# EasyEDA schematic SCH_SMD VR Conditioner_2023-05-26.json
TITLE: Sheet_1; REV: 1.0; Date: 2022-03-04; Sheet: 1/1; Drawn By: Norman Alphaspeed; Company: Your Company
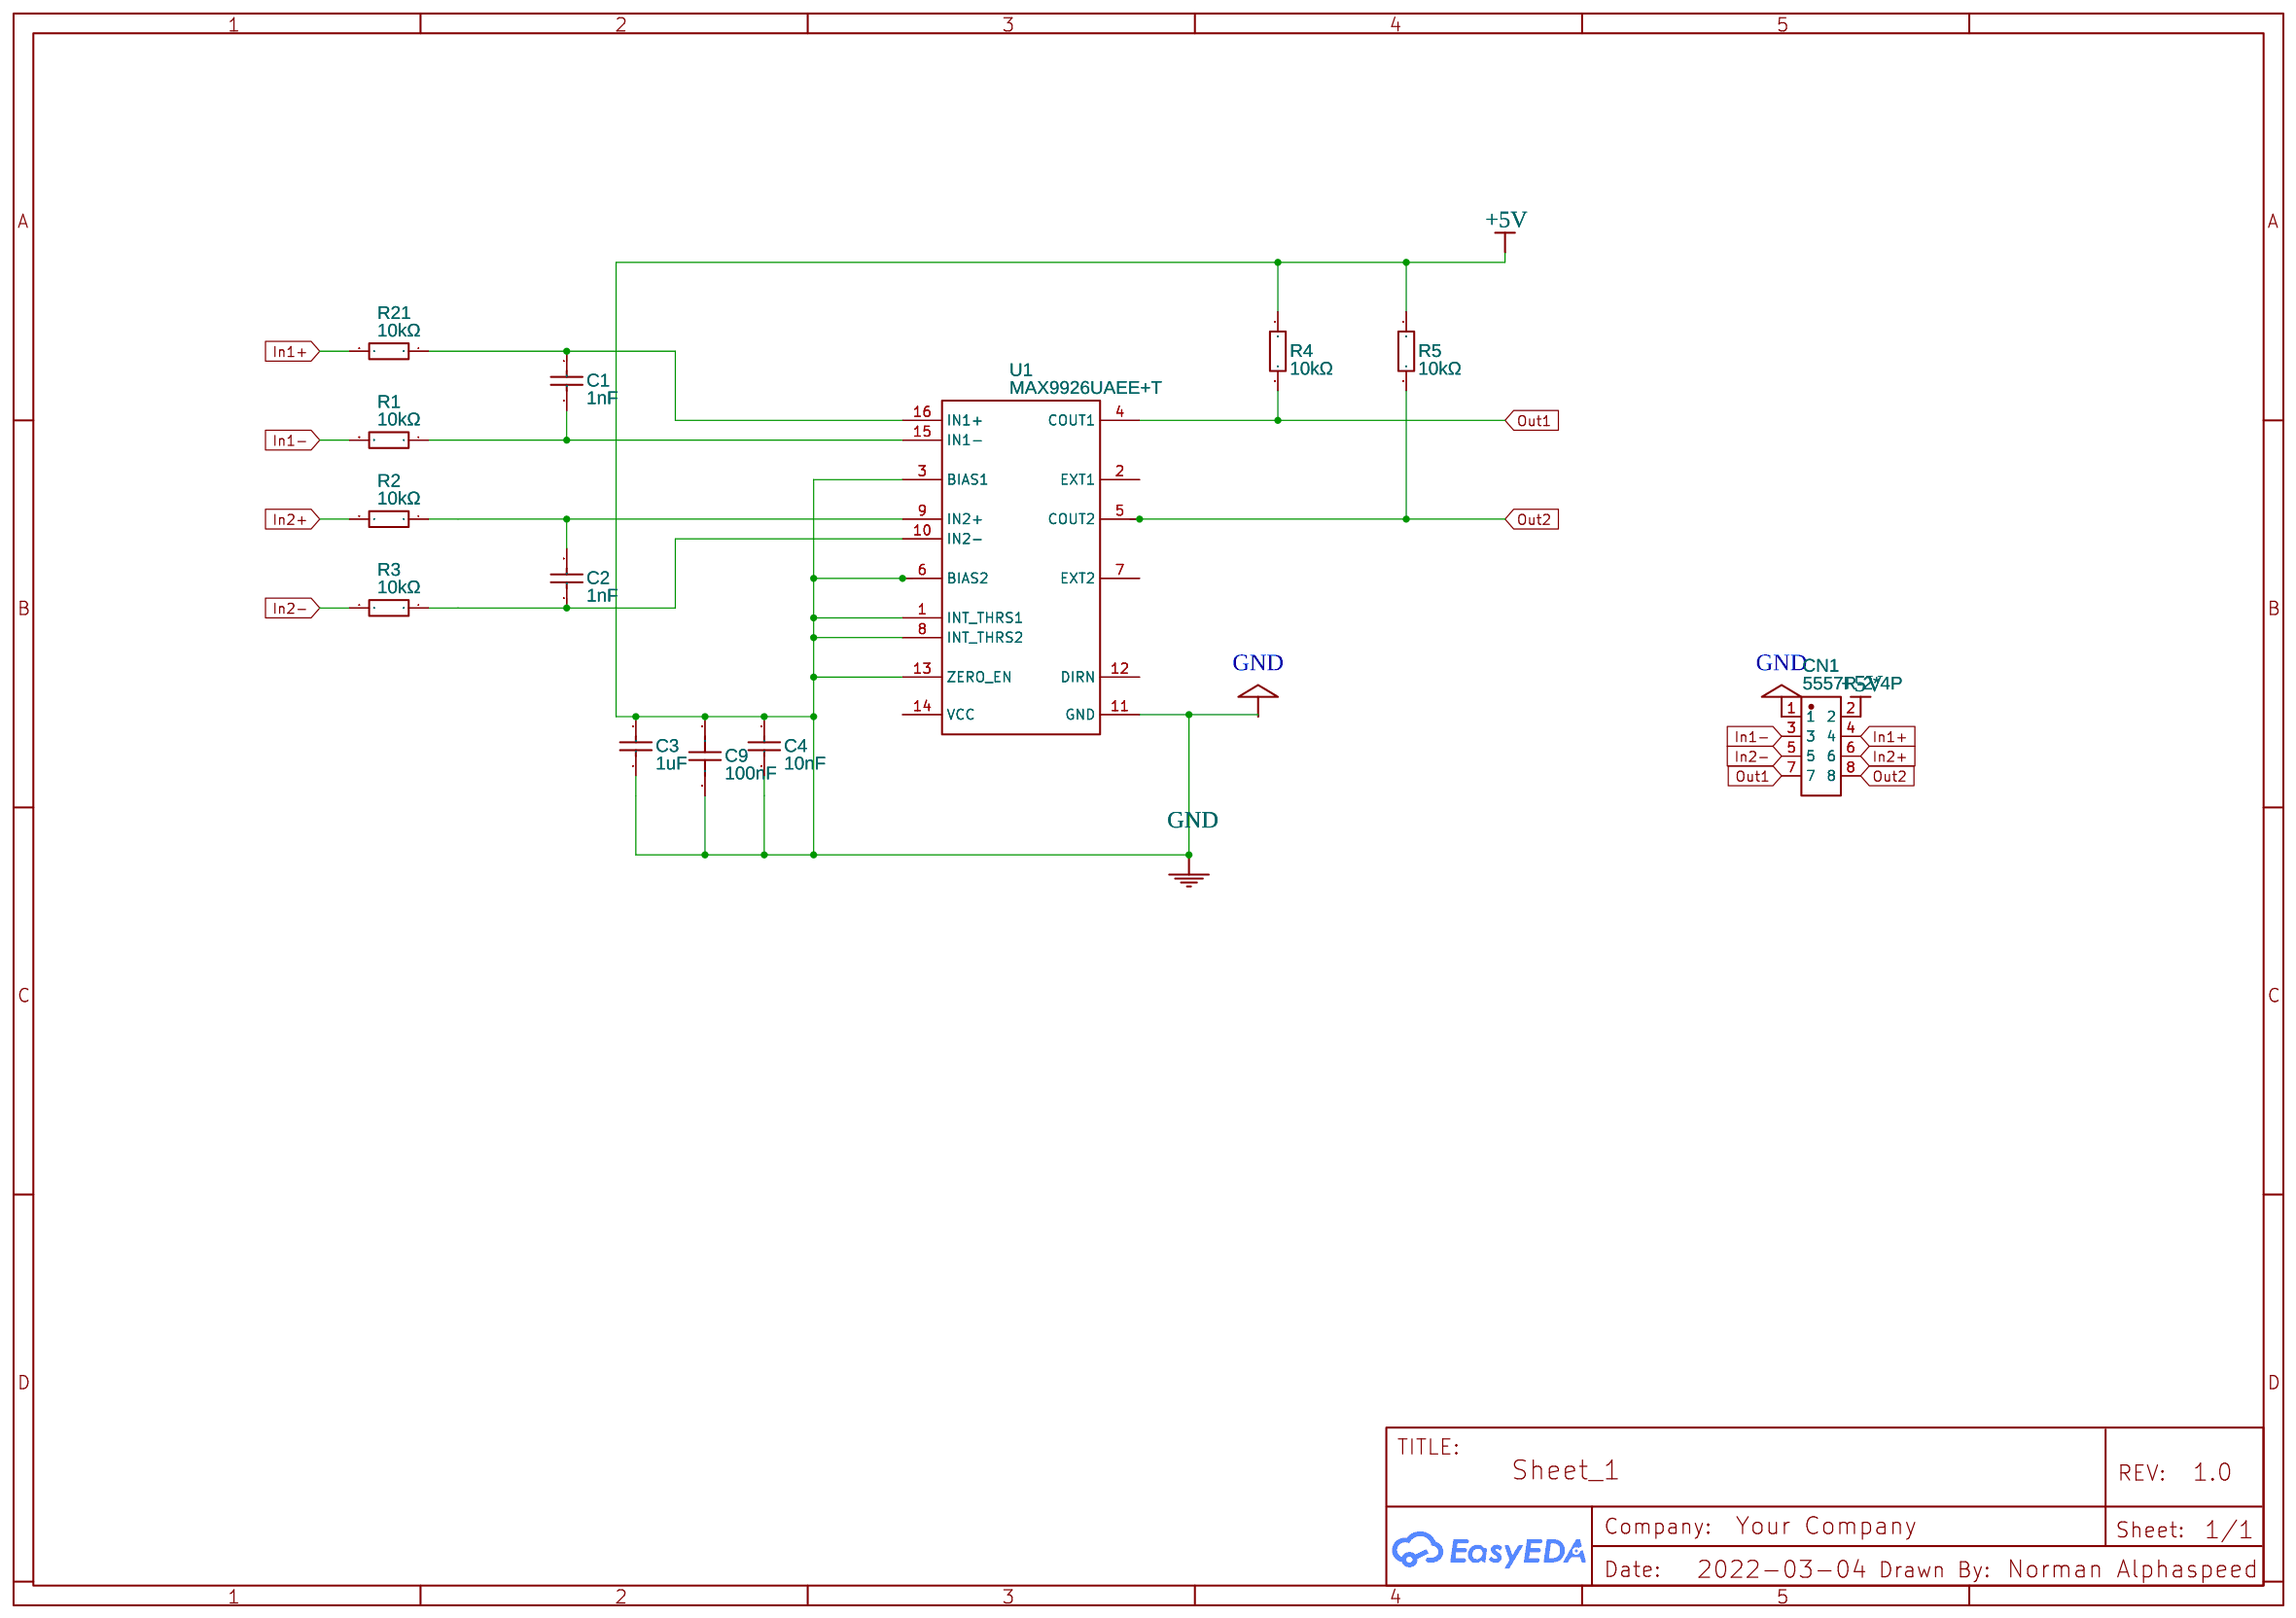
[diagram p0: schematic sheet]

## Parts
C1  1nF  [C0603]
C2  1nF  [C0603]
C3  1uF  [C0603]
C4  10nF  [C0402]
C9  100nF  [C0603]
CN1  5557R-2*4P  [CONN-TH_8P-P4.20_5557R-2X4P]
R1  10kΩ  [R0402]
R2  10kΩ  [R0402]
R3  10kΩ  [R0402]
R4  10kΩ  [R0402]
R5  10kΩ  [R0402]
R21  10kΩ  [R0402]
U1  MAX9926UAEE+T  [QSOP-16_150MIL]

## Library data of the parts
C1 C2 = CL10B102KB8NNNC: Supplier: LCSC; Manufacturer: SAMSUNG; Supplier Part: C1588; JLCPCB Part Class: Basic Part
C3 = CL10A105KB8NNNC: Supplier: LCSC; Manufacturer: SAMSUNG; Supplier Part: C15849; JLCPCB Part Class: Basic Part
C4 = CL05B103KB5NNNC: Supplier: LCSC; Manufacturer: SAMSUNG; Supplier Part: C15195; JLCPCB Part Class: Basic Part
C9 = CC0603KRX7R9BB104: Supplier: LCSC; Manufacturer: YAGEO; Supplier Part: C14663; JLCPCB Part Class: Basic Part
CN1 = 5557R-2*4P: Supplier: LCSC; Supplier Part: C477838; Manufacturer: Ckmtw(Shenzhen Cankemeng); Contributor: LCSC; JLCPCB Part Class: Extended Part
R1-R5 R21 = 0402WGF1002TCE: Supplier: LCSC; Manufacturer: UniOhm; Supplier Part: C25744; Resistance (Ohms): 10K; JLCPCB Part Class: Basic Part
U1 = -: Dual-Channel, Variable Reluctance Sensor Interface with No Low Power Shutdown, 4.5 to 5.5 V, -40 to 125 degC, 16-Pin SOP (E16+1), Pb-Free, Tape and Reel; Manufacturer Part: ?

## Nets
+5V: C3.1 C3.2 C4.1 C4.2 C9.1 C9.2 CN1.1 CN1.2 R4.1 R5.1 U1.1(INT_THRS1) U1.3(BIAS1) U1.6(BIAS2) U1.8(INT_THRS2) U1.11(GND) U1.13(ZERO_EN)
In1+: CN1.4 R21.2
In1-: CN1.3 R1.2
In2+: CN1.6 R2.2
In2-: CN1.5 R3.2
Out1: CN1.7 R4.2 U1.4(COUT1)
Out2: CN1.8 R5.2 U1.5(COUT2)
Net-(C1-1): C1.1 R1.1 U1.15(IN1-)
Net-(C1-2): C1.2 R21.1 U1.16(IN1+)
Net-(C2-1): C2.1 R3.1 U1.10(IN2-)
Net-(C2-2): C2.2 R2.1 U1.9(IN2+)

Not connected (* = marked no-connect by the designer): U1 2(EXT1) 7(EXT2) 12(DIRN) 14(VCC)
